# EAGLE design ESP-WROOM-32-Breakout (EAGLE 7.2.0)
REV: 1
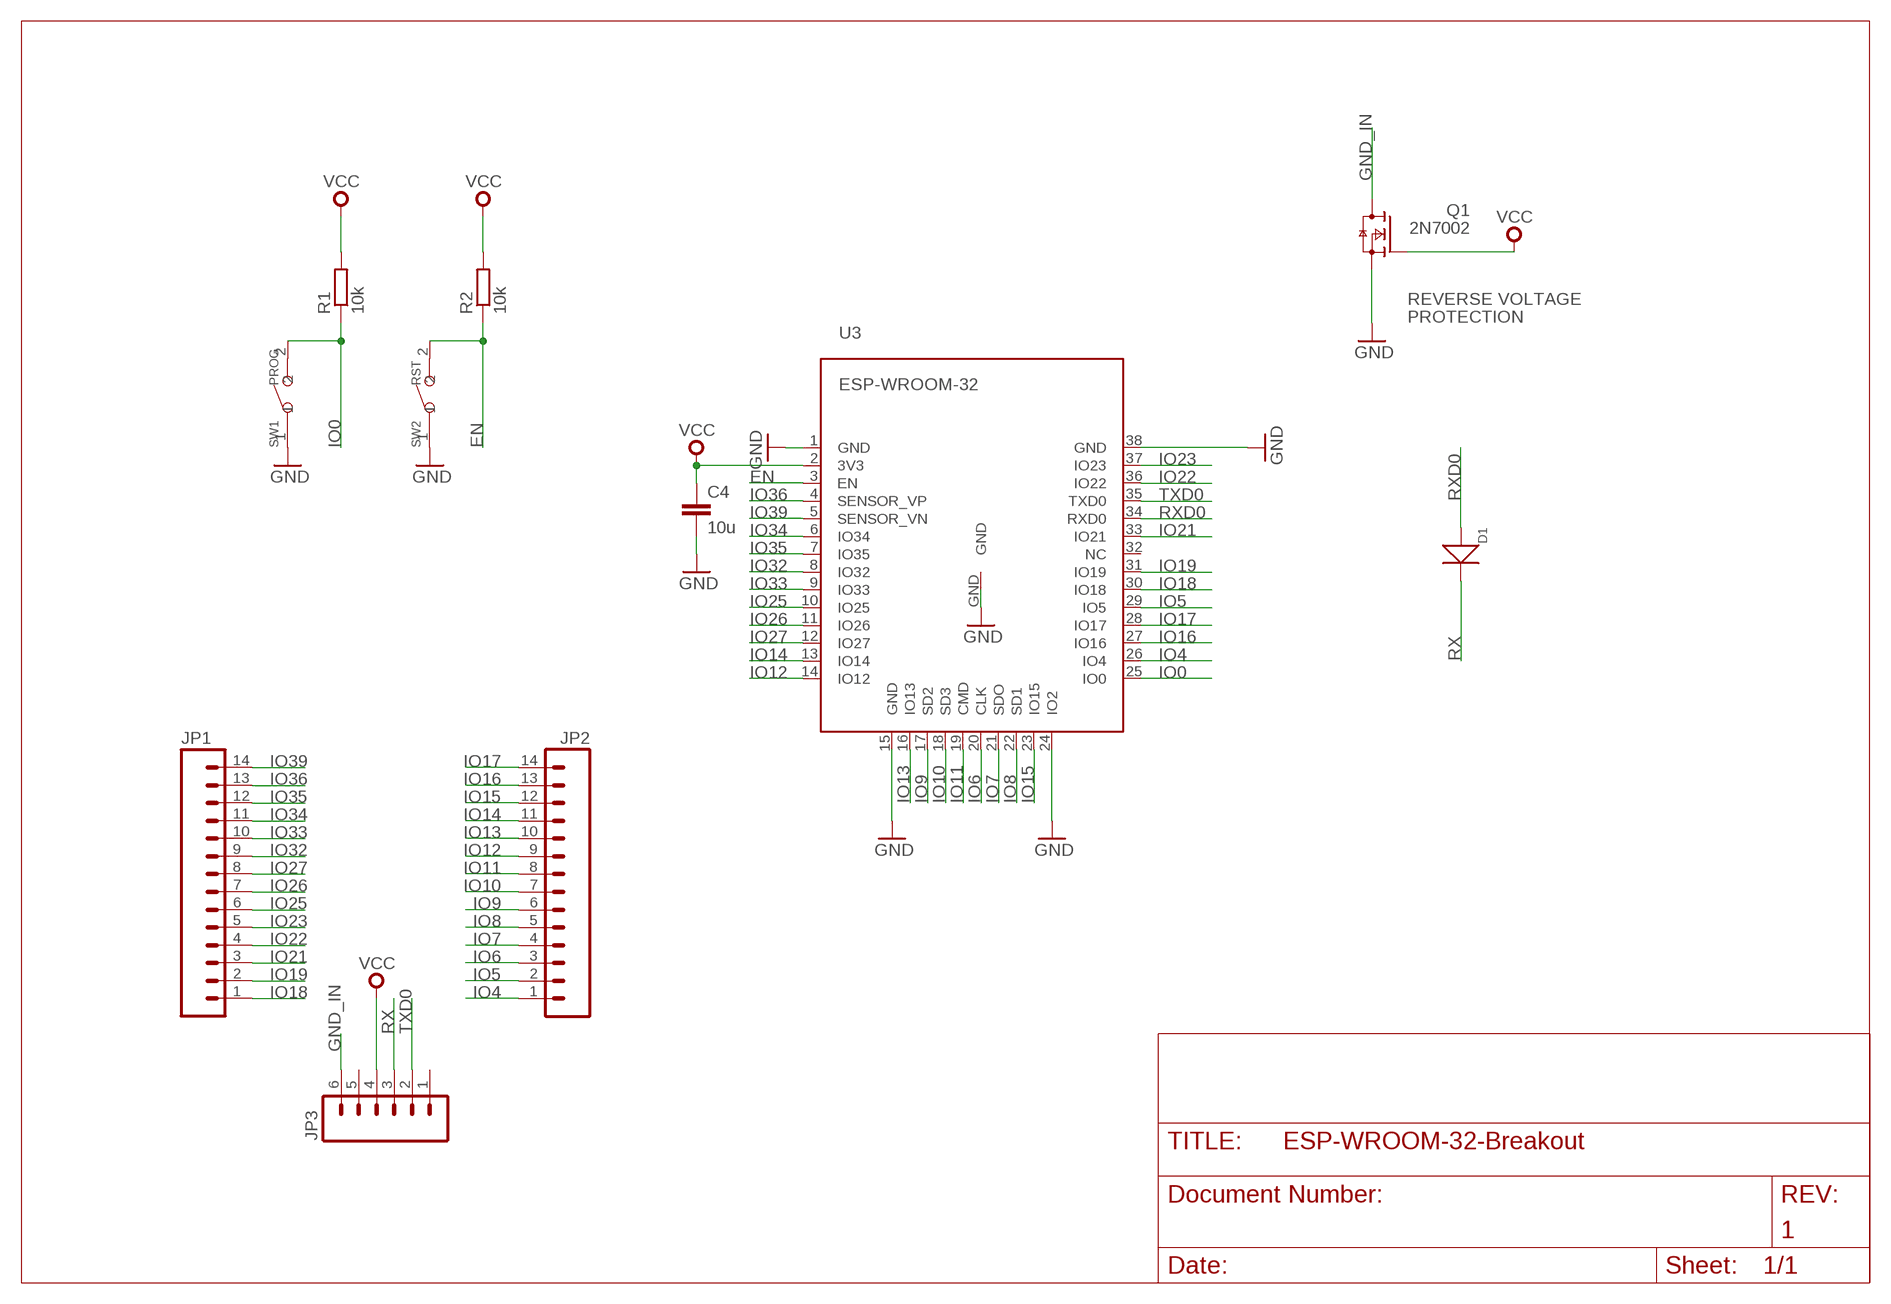
[diagram p0: schematic, sheet 1]

## Parts
C4  10u  C-EUC0603  [C0603]
D1  DIODE'0805'  [SOD-323]
JP1  M14  [1X14]
JP2  M14  [1X14]
JP3  M06SILK_FEMALE_PTH  [1X06]
Q1  2N7002  2N7002E  [SOT23]
R1  10k  R-EU_R0603  [R0603]
R2  10k  R-EU_R0603  [R0603]
SW1  PROG  SMD-BUTTON(2P-6.0X3.0X2.5MM)-DHT-1163S  [SW2-4.0-6.0X3.0X2.5MM]
SW2  RST  SMD-BUTTON(2P-6.0X3.0X2.5MM)-DHT-1163S  [SW2-4.0-6.0X3.0X2.5MM]
U3  ESP-WROOM-32  [ESP-WROOM-32]

## Nets
EN: R2.1 SW2.2 U3.3(EN)
GND [gnd]: C4.2 Q1.2(S) SW1.1 SW2.1 U3.1(GND) U3.15(GND) U3.24(IO2) U3.38(GND) U3.GND
GND_IN [gnd]: JP3.6 Q1.3(D)
IO0: R1.1 SW1.2 U3.25(IO0)
IO4: JP2.1 U3.26(IO4)
IO5: JP2.2 U3.29(IO5)
IO6: JP2.3 U3.20(CLK)
IO7: JP2.4 U3.21(SDO)
IO8: JP2.5 U3.22(SD1)
IO9: JP2.6 U3.17(SD2)
IO10: JP2.7 U3.18(SD3)
IO11: JP2.8 U3.19(CMD)
IO12: JP2.9 U3.14(IO12)
IO13: JP2.10 U3.16(IO13)
IO14: JP2.11 U3.13(IO14)
IO15: JP2.12 U3.23(IO15)
IO16: JP2.13 U3.27(IO16)
IO17: JP2.14 U3.28(IO17)
IO18: JP1.1 U3.30(IO18)
IO19: JP1.2 U3.31(IO19)
IO21: JP1.3 U3.33(IO21)
IO22: JP1.4 U3.36(IO22)
IO23: JP1.5 U3.37(IO23)
IO25: JP1.6 U3.10(IO25)
IO26: JP1.7 U3.11(IO26)
IO27: JP1.8 U3.12(IO27)
IO32: JP1.9 U3.8(IO32)
IO33: JP1.10 U3.9(IO33)
IO34: JP1.11 U3.6(IO34)
IO35: JP1.12 U3.7(IO35)
IO36: JP1.13 U3.4(SENSOR_VP)
IO39: JP1.14 U3.5(SENSOR_VN)
RX: D1.- JP3.3
RXD0: D1.+ U3.34(RXD0)
TXD0: JP3.2 U3.35(TXD0)
VCC [vcc]: C4.1 JP3.4 Q1.1(G) R1.2 R2.2 U3.2(3V3)
Unconnected: JP3.1 JP3.5 U3.32(NC)

## Notes on the sheet
- REVERSE VOLTAGE
- PROTECTION

## Library data of the parts
C4 = rcl:C-EU: CAPACITOR, European symbol
D1 = Seeed-OPL-Diode:DIODE*
JP1 JP2 = SparkFun-Connectors:M14: Header 14 Standard 14-pin 0.1" header. Use with straight break away headers (SKU : PRT-00116), right angle break away headers (PRT-00553), swiss pins (PRT-00743), machine pins (PRT-00117), and female headers (PRT-00115).
JP3 = SparkFun-Connectors:M06: Header 6 Standard 6-pin 0.1" header. Use with straight break away headers (SKU : PRT-00116), right angle break away headers (PRT-00553), swiss pins (PRT-00743), machine pins (PRT-00117), and female headers (PRT-00115). Molex polarized connector foot print use with SKU : PRT-08094 with associated crimp pins and housings. NOTES ON THE VARIANTS LOCK and LOCK_LONGPADS... This footprint was designed to help hold the alignment of a through-hole component (i.e. 6-pin header) while soldering it into place. You may notice that each hole has been shifted either up or down by 0.005 of an inch from it's more standard position (which is a perfectly straight line). This slight alteration caused the pins (the squares in the middle) to touch the edges of the holes. Because they are alternating, it causes a "brace" to hold the component in place. 0.005 has proven to be the perfect amount of "off-center" position when using our standard breakaway headers. Although looks a little odd when you look at the bare footprint, once you have a header in there, the alteration is very hard to notice. Also,if you push a header all the way into place, it is covered up entirely on the bottom side. This idea of altering the position of holes to aid alignment will be further integrated into the Sparkfun Library for other footprints. It can help hold any component with 3 or more connection pins.; PROD_ID: CONN-08437
Q1 = nxp_60_1_1:2N7002: N-channel TrenchMOS FET N-channel enhancement mode Field-Effect Transistor (FET) in a plastic package using TrenchMOS technology. AAL Eindhoven MK
R1 R2 = rcl:R-EU_: RESISTOR, European symbol
SW1 SW2 = Seeed-OPL-Switch:SMD-BUTTON(2P-6.0X3.0X2.5MM): 311020029
U3 = esp32:ESP-WROOM-32

## Net classes
0 default: width 0.254 mm, drill 0.305 mm, clearance 0.152 mm
1 gnd: width 0.635 mm, drill 0.635 mm, clearance 0.254 mm
2 vcc: width 0.406 mm, drill 0.406 mm, clearance 0.254 mm

## Board
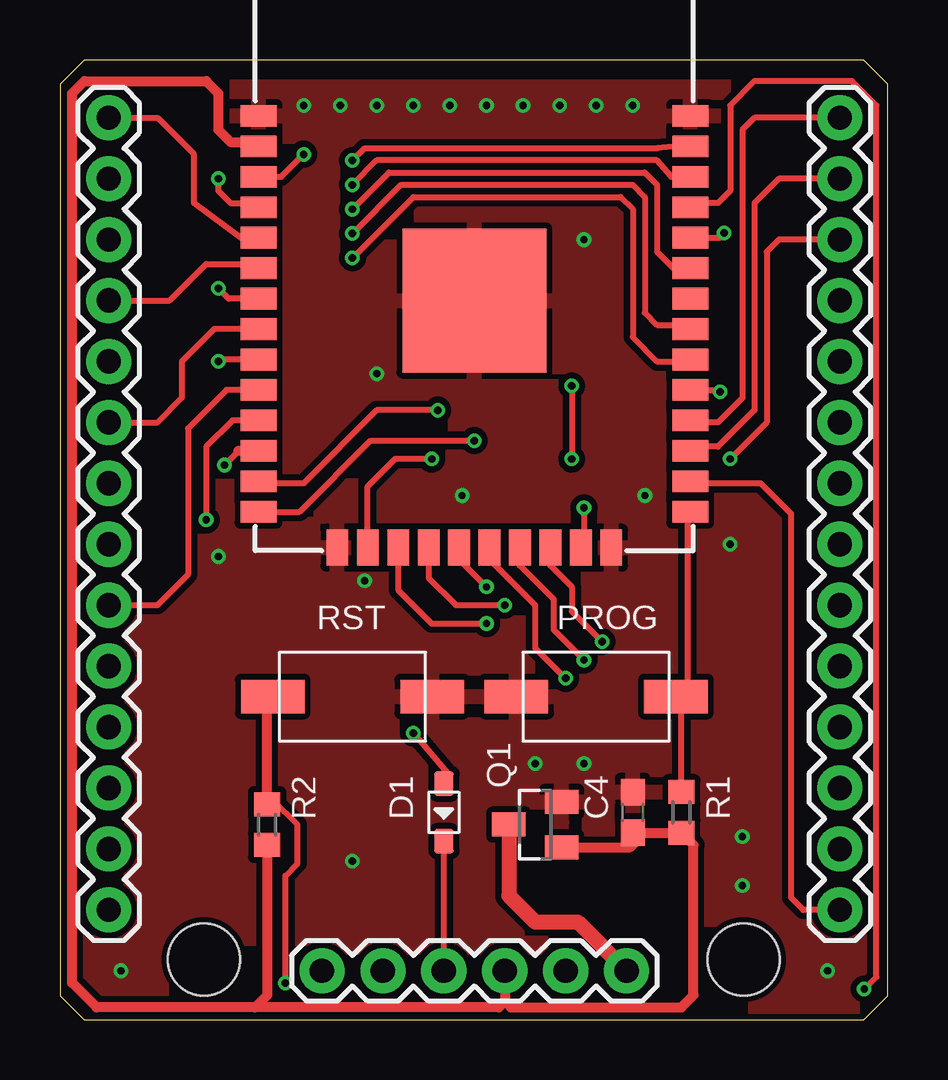
[diagram p1: board, top side]
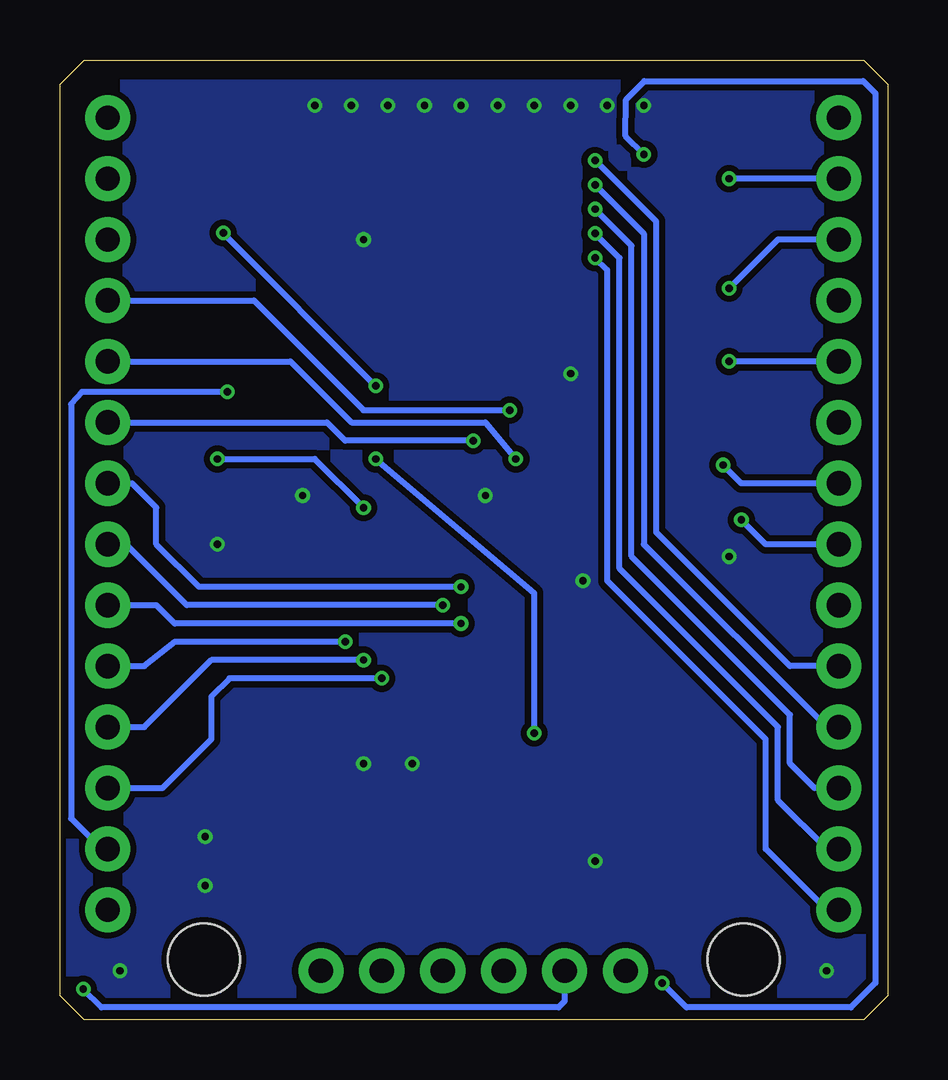
[diagram p2: board, bottom side, seen from below]

Size 34.5 x 40 mm. Coordinates in mm from the lower left corner, seen from the top.
Outline: 34.5,1 34.5,39 33.5,40 1,40 0,39 0,1 1,0 33.5,0 34.5,1
Copper layers (1*16): Top 0.035mm / dielectric 1.5mm / Bottom 0.035mm
Design rules "dirt_cheap_dirty_boards.v1": minimum track width 5mil, minimum drill 12mil, track to track 5mil, track to pad 5mil, pad to pad 5mil, via to via 5mil, smd to smd 0mil, copper to edge 10mil, drill to drill 10mil, minimum pad ring 10mil, minimum via ring 6mil, stop-mask expansion 2mil, vias tented up to drill 25mil, thermal gap 10mil
Holes 3 mm at 6,2.5 28.5,2.5

### Footprints (pad centres in the part's own frame; a part is rotated, then mirrored left to right if it is on the bottom)
C0603 = smd 1.1 x 1: 1 -0.85,0; 2 0.85,0
SOD-323 = smd 1 x 0.8: + -1.2,0; - 1.2,0
1X14 = drill 1.016 pad 1.88: 1 0,0; 2 2.54,0; 3 5.08,0; 4 7.62,0; 5 10.16,0; 6 12.7,0; 7 15.24,0; 8 17.78,0; 9 20.32,0; 10 22.86,0; 11 25.4,0; 12 27.94,0; 13 30.48,0; 14 33.02,0
1X06 = drill 1.016 pad 1.88: 1 0,0; 2 2.54,0; 3 5.08,0; 4 7.62,0; 5 10.16,0; 6 12.7,0
SOT23 = smd 1 x 1.4: 1 -0.95,-1.1; 2 0.95,-1.1; 3 0,1.1
R0603 = smd 1 x 1.1: 1 -0.85,0; 2 0.85,0
SW2-4.0-6.0X3.0X2.5MM = smd 2.65 x 1.4: 1 -3.325,0; 2 3.325,0
ESP-WROOM-32 = smd 0.9 x 1.5: 1 7.7,9; 2 6.43,9; 3 5.16,9; 4 3.89,9; 5 2.62,9; 6 1.35,9; 7 0.08,9; 8 -1.19,9; 9 -2.46,9; 10 -3.73,9; 11 -5,9; 12 -6.27,9; 13 -7.54,9; 14 -8.81,9; 25 -8.81,-9; 26 -7.54,-9; 27 -6.27,-9; 28 -5,-9; 29 -3.73,-9; 30 -2.46,-9; 31 -1.19,-9; 32 0.08,-9; 33 1.35,-9; 34 2.62,-9; 35 3.89,-9; 36 5.16,-9; 37 6.43,-9; 38 7.7,-9 | smd 1.5 x 0.9: 15 -10.3,5.715; 16 -10.3,4.445; 17 -10.3,3.175; 18 -10.3,1.905; 19 -10.3,0.635; 20 -10.3,-0.635; 21 -10.3,-1.905; 22 -10.3,-3.175; 23 -10.3,-4.445; 24 -10.3,-5.715 | smd 6 x 6: GND 0,0

### Placement (x,y rotation side)
C4  23.88,8.64 90 top
D1  16,8.64 270 top
JP1  2.03,4.57 90 top
JP2  32.51,4.57 90 top
JP3  10.92,2.03 0 top
Q1  19.81,8.13 90 top
R1  25.91,8.64 270 top
R2  8.64,8.13 270 top
SW1  22.35,13.46 0 top
SW2  12.19,13.46 180 top
U3  17.27,29.97 90 top

### Tracks (layer width: path | path; a pad name or v marks a point on that pad's centre or on a via)
EN  (via drill 0.3)
  Top 0.254: U3.3 9.22,35.13 v10.16,36.07 | v9.4,1.52 9.4,6 9.91,6.51 9.91,8.13 8.89,9.14 8.29,9.14
  Top 0.406: SW2.2 8.64,13.21 R2.1 8.29,9.14
  Bottom 0.254: v10.16,36.07 10.92,36.83 10.91,38.35 10.14,39.12 1.02,39.12 0.51,38.61 0.51,1.52 1.52,0.51 8.38,0.51 v9.4,1.52
GND  (via drill 0.3)
  other vias: 10.16,38.1 11.68,38.1 13.21,38.1 14.73,38.1 16.26,38.1 17.78,38.1 19.3,38.1 20.83,38.1 22.35,38.1 23.88,38.1 27.94,19.81 24.38,21.84 12.7,18.29 28.45,7.62 28.45,5.59 32,2.03 12.19,6.6 2.54,2.03 6.6,19.3 13.21,26.92 21.84,32.51 16.76,21.84 19.81,10.67 21.84,10.67
  pour Bottom: 0,38.86 34.54,38.86 34.54,1 33.54,0 1,0 0,1
  pour Top: 34.54,38.86 0,38.86 0,1 1,0 33.54,0 34.54,1
GND_IN
  Top 0.635: Q1.3 18.71,5.16 19.81,4.06 21.59,4.06 JP3.6
IO0
  Top 0.254: 26.16,21.05 26.16,14.05 arc-45 26.09,13.87 SW1.2 25.83,13.3 arc-45 25.91,13.13 R1.1
  Top 0.406: 26.16,12.98 SW1.2 | 26.16,21.05 U3.25
IO4
  Top 0.254: U3.26 26.35,22.35 29.21,22.35 30.48,21.08 30.48,5.08 30.99,4.57 JP2.1
IO5  (via drill 0.3)
  Top 0.254: U3.29 27.54,26.24 v27.52,26.17
  Bottom 0.254: v27.52,26.17 33.58,26.17 34.04,25.65 34.04,8.38 32.77,7.11 JP2.2
IO6  (via drill 0.3)
  Top 0.254: U3.20 17.91,19.18 19.81,17.27 19.81,15.49 v21.08,14.22
  Bottom 0.254: v21.08,14.22 27.43,14.22 28.19,13.46 28.19,11.68 30.23,9.65 JP2.3
IO7  (via drill 0.3)
  Top 0.254: U3.21 19.18,18.92 20.57,17.53 20.57,16.26 v21.84,14.99
  Bottom 0.254: v21.84,14.99 28.19,14.99 30.99,12.19 JP2.4
IO8  (via drill 0.3)
  Top 0.254: U3.22 20.45,18.92 21.34,18.03 21.34,17.02 v22.61,15.75
  Bottom 0.254: v22.61,15.75 29.72,15.75 30.99,14.73 JP2.5
IO9  (via drill 0.3)
  Top 0.254: U3.17 14.1,17.91 15.49,16.51 v17.78,16.51
  Bottom 0.254: v17.78,16.51 29.72,16.51 30.48,17.27 JP2.6
IO10  (via drill 0.3)
  Top 0.254: U3.18 15.37,18.41 16.51,17.27 v18.54,17.27
  Bottom 0.254: v18.54,17.27 29.21,17.27 31.75,19.81 JP2.7
IO11  (via drill 0.3)
  Top 0.254: U3.19 16.64,19.18 v17.78,18.03
  Bottom 0.254: v17.78,18.03 28.7,18.03 30.48,19.81 30.48,21.34 31.5,22.35 JP2.8
IO12  (via drill 0.3)
  Top 0.254: U3.14 9.99,21.16 12.95,24.13 v17.27,24.13
  Bottom 0.254: v17.27,24.13 22.61,24.13 23.37,24.89 JP2.9
IO13  (via drill 0.3)
  Top 0.254: v15.49,23.37 13.97,23.37 12.83,22.23 U3.16
  Bottom 0.254: v15.49,23.37 16.76,24.89 22.35,24.89 24.89,27.43 JP2.10
IO14  (via drill 0.3)
  Top 0.254: v15.75,25.4 13.21,25.4 10.16,22.35 8.35,22.35 U3.13
  Bottom 0.254: v15.75,25.4 21.84,25.4 26.42,29.97 JP2.11
IO15  (via drill 0.3)
  Top 0.254: v27.94,23.37 29.46,24.89 29.46,32 29.97,32.51 JP2.12 | v21.84,21.34 21.84,19.8 U3.23
  Bottom 0.254: v27.94,23.37 23.88,23.37 v21.84,21.34
IO16
  Top 0.254: U3.27 26.45,23.88 27.43,23.88 28.96,25.4 28.96,34.04 29.97,35.05 JP2.13
IO17
  Top 0.254: U3.28 26.35,24.89 27.43,24.89 28.45,25.91 28.45,37.08 28.96,37.59 JP2.14
IO18  (via drill 0.3)
  Top 0.254: v12.19,31.75 14.73,34.29 23.37,34.29 23.88,33.78 23.88,28.45 24.89,27.43 26.19,27.43 U3.30
  Bottom 0.254: v12.19,31.75 11.68,31.24 11.68,18.29 5.08,11.68 5.08,7.11 2.54,4.57 JP1.1
IO19  (via drill 0.3)
  Top 0.254: v12.19,32.77 14.22,34.8 23.88,34.8 24.38,34.29 24.38,29.46 24.89,28.96 26.1,28.96 U3.31
  Bottom 0.254: v12.19,32.77 11.18,31.75 11.18,18.8 4.57,12.19 4.57,9.14 2.54,7.11 JP1.2
IO21  (via drill 0.3)
  Top 0.254: v12.19,33.78 13.72,35.31 24.38,35.31 24.89,34.8 24.89,32 25.91,30.99 25.94,30.99 U3.33
  Bottom 0.254: v12.19,33.78 10.67,32.26 10.67,19.3 4.06,12.7 4.06,10.67 3.05,9.65 JP1.3
IO22  (via drill 0.3)
  Top 0.254: U3.36 25.48,35.13 24.89,35.81 13.21,35.81 v12.19,34.8
  Bottom 0.254: v12.19,34.8 10.16,32.77 10.16,19.81 2.54,12.19 JP1.4
IO23  (via drill 0.3)
  Top 0.254: U3.37 25.73,36.4 24.89,36.32 12.7,36.32 v12.19,35.81
  Bottom 0.254: v12.19,35.81 9.65,33.27 9.65,20.32 4.06,14.73 JP1.5
IO25
  Top 0.254: U3.10 6.94,26.24 5.33,24.64 5.33,18.54 4.06,17.27 JP1.6
IO26  (via drill 0.3)
  Top 0.254: U3.11 7.19,24.97 6.1,23.88 v6.1,20.83
  Bottom 0.254: v6.1,20.83 5.08,19.81 JP1.7
IO27  (via drill 0.3)
  Top 0.254: 7.45,23.7 v6.86,23.11
  Top 0.406: U3.12 7.45,23.7
  Bottom 0.254: v6.86,23.11 6.1,22.35 JP1.8
IO32
  Top 0.254: U3.8 6.43,28.78 5.08,27.43 5.08,25.91 4.06,24.89 JP1.9
IO33  (via drill 0.3)
  Top 0.254: U3.9 6.68,27.51
  Top 0.406: 6.68,27.51 v6.6,27.43
  Bottom 0.254: JP1.10 v6.6,27.43
IO34
  Top 0.254: 8.1,31.5 6.1,31.5 4.57,29.97 JP1.11
  Top 0.406: 8.1,31.5 U3.6
IO35  (via drill 0.3)
  Top 0.254: U3.7 7.03,30.05 v6.6,30.48
  Bottom 0.254: v6.6,30.48 4.57,32.51 JP1.12
IO36  (via drill 0.3)
  Top 0.254: v6.6,35.05 6.6,34.54 7.11,34.04 8.1,34.04
  Top 0.406: 8.1,34.04 U3.4
  Bottom 0.254: JP1.13 v6.6,35.05
IO39
  Top 0.254: U3.5 7.54,32.59 5.59,34.04 5.59,36.07 4.06,37.59 JP1.14
RX
  Top 0.254: JP3.3 D1.-
RXD0  (via drill 0.3)
  Top 0.254: U3.34 27.49,32.59 v27.69,32.79 | v21.34,26.42 v21.34,23.37 | v14.73,11.94 16.26,10.16 D1.+
  Bottom 0.254: v27.69,32.79 27.69,32.77 v21.34,26.42 | v21.34,23.37 14.73,17.78 v14.73,11.94
TXD0  (via drill 0.3)
  Top 0.254: v33.53,1.27 34.04,1.78 34.04,38.1 33.02,39.12 28.96,39.12 27.94,38.1 27.94,34.54 27.43,34.04 26.45,34.04 U3.35
  Bottom 0.254: v33.53,1.27 32.77,0.51 13.72,0.51 13.46,0.76 JP3.2
VCC
  Top 0.406: 18.54,0.76 18.29,0.51 8.13,0.51 | 8.13,0.51 1.52,0.51 0.51,1.52 0.51,38.61 1.02,39.12 6.1,39.12 6.6,38.61 6.6,37.08 7.11,36.58 8.1,36.58 U3.2 | Q1.1 23.78,7.18 24.05,7.45 23.88,7.62 | 23.88,7.62 24.04,7.79 R1.2 26.42,7.28 26.42,1.02 25.91,0.51 18.8,0.51 18.54,0.76 | JP3.4 18.54,0.76 | C4.1 23.88,7.62 | R2.2 8.64,1.02 8.13,0.51

### Text on the board
tDocu: 39 | 17 | 36 | 16 | 35 | 15 | 34 | 14 | 33 | 13 | 32 | 12 | 27 | 11 | 26 | 10 | 25 | 9 | 23 | 8 | 22 | 7 | 21 | 6 | 19 | 5 | 18 | TX | RX | V+ | GND | 4
bDocu: ESP-WROOM-32 Breakout | By Studio Sophisti